# Altium schematic sheet Oximeter.SchDoc: Oximeter
size A3; SheetNumber: -; SheetTotal: -; RDL_Ersteller: Heig; RDL_FreigabeDatum: -; RDL_ErstellDatum: 09.12.2018; RDL_Freigegeben: -; RDL_Geaendert: -; RDL_GeaendertDatum: -; RDL_OrgEinheit: -; PageSetup: Record=PageOptions|CenterHorizontal=True|CenterVertical=True|PrintScale=1.00|XCorrection=1.00|YCorrection=1.00|PrintKind=0|BorderSize=5000000|LeftOffset=0|BottomOffset=0|Orientation=2|PaperLength=1000|PaperWidth=1000|Scale=100|PaperSource=7|PrintQuality=-3|MediaType=1|DitherType=10|PrintScaleMode=1|PaperKind=A4|PaperIndex=9; ProjectName: Oximeter
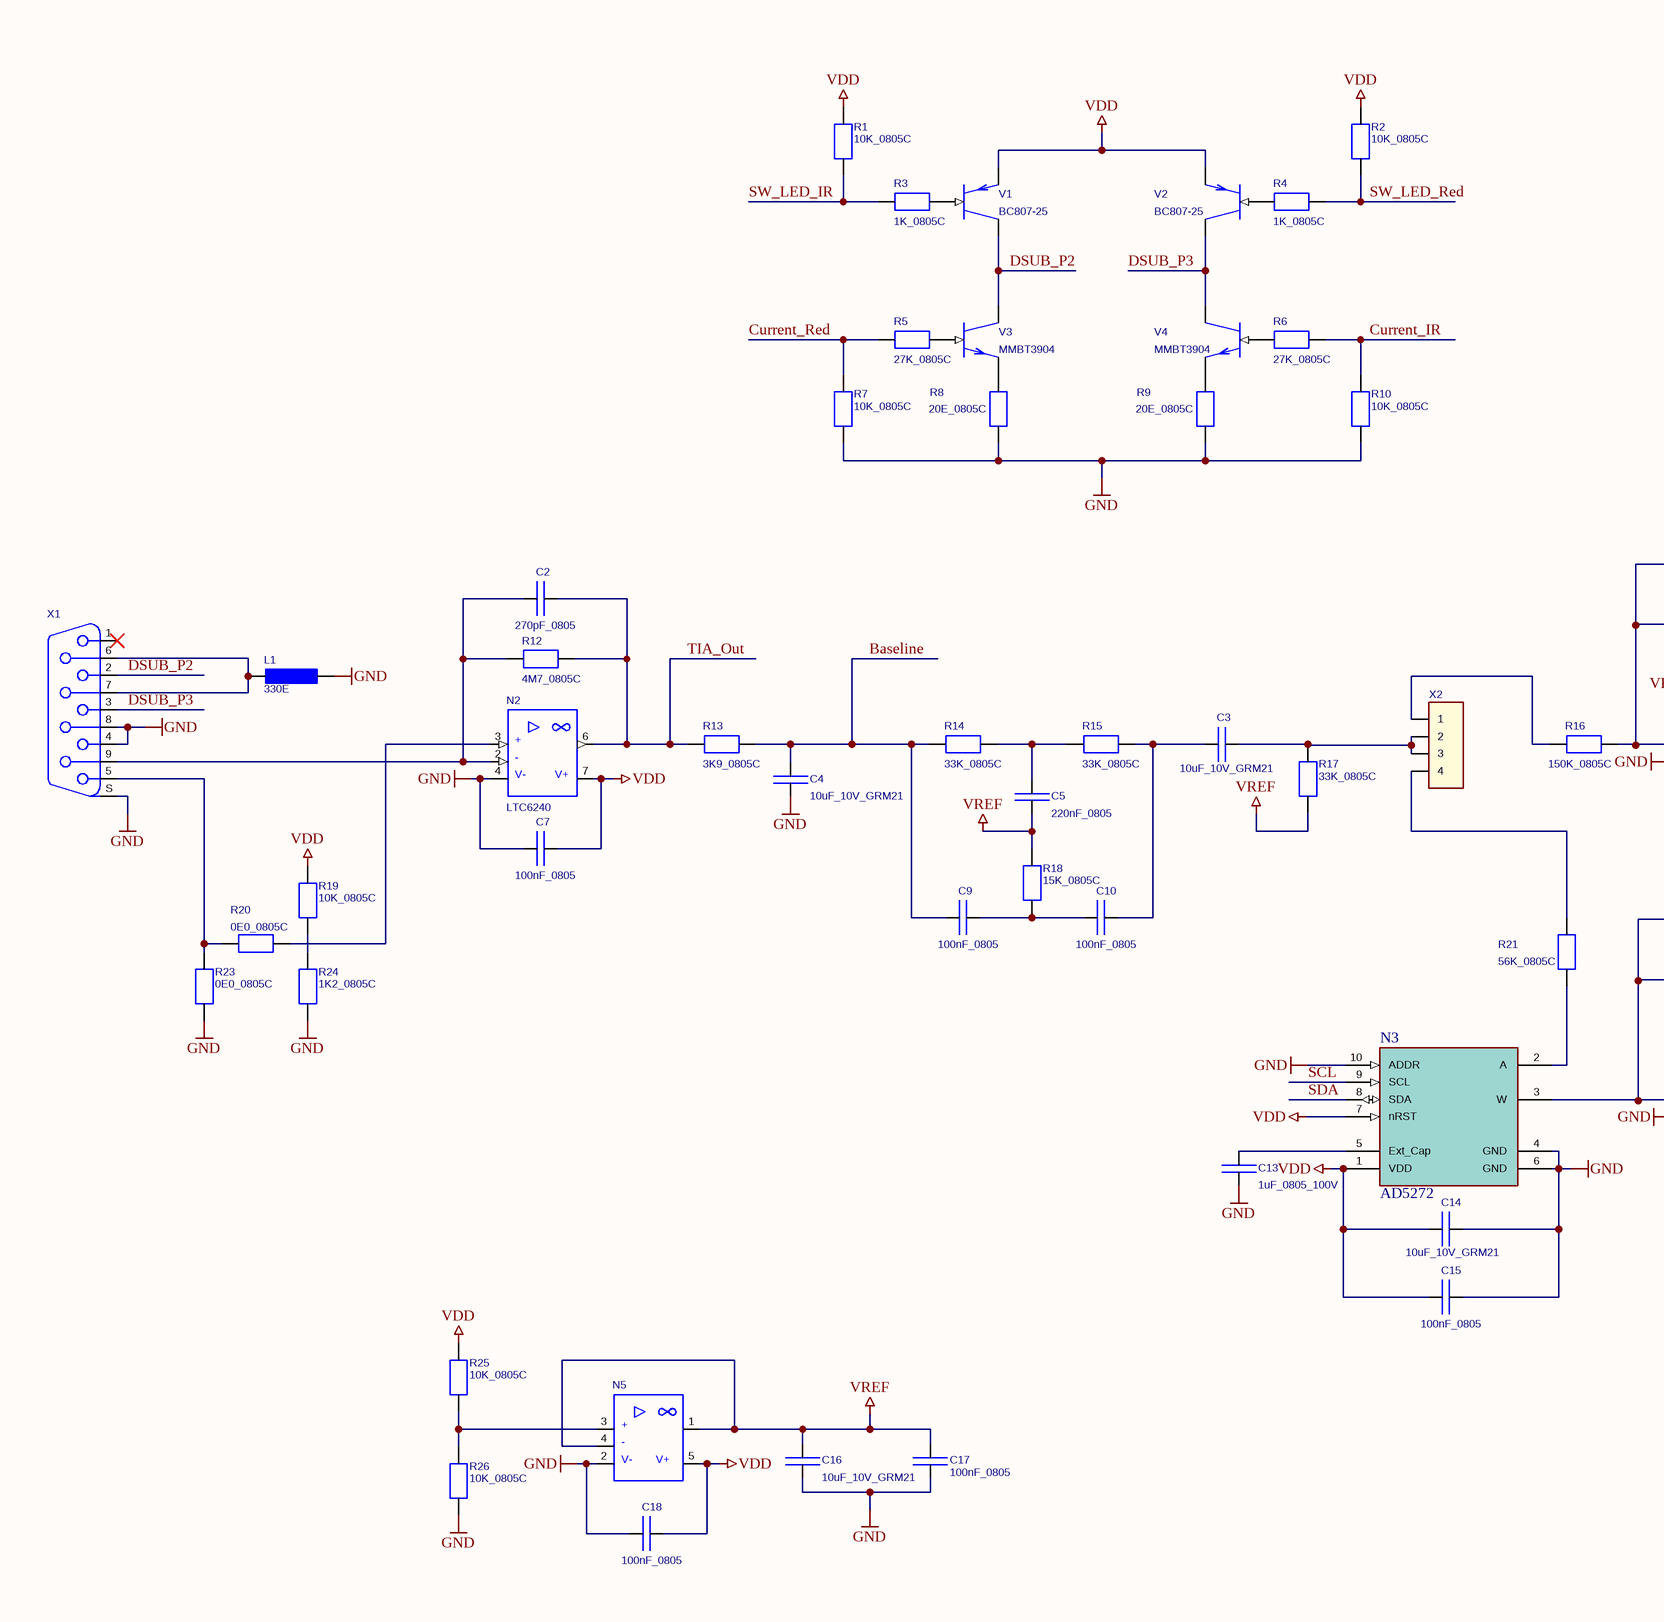
[diagram p0: Oximeter.SchDoc, left]
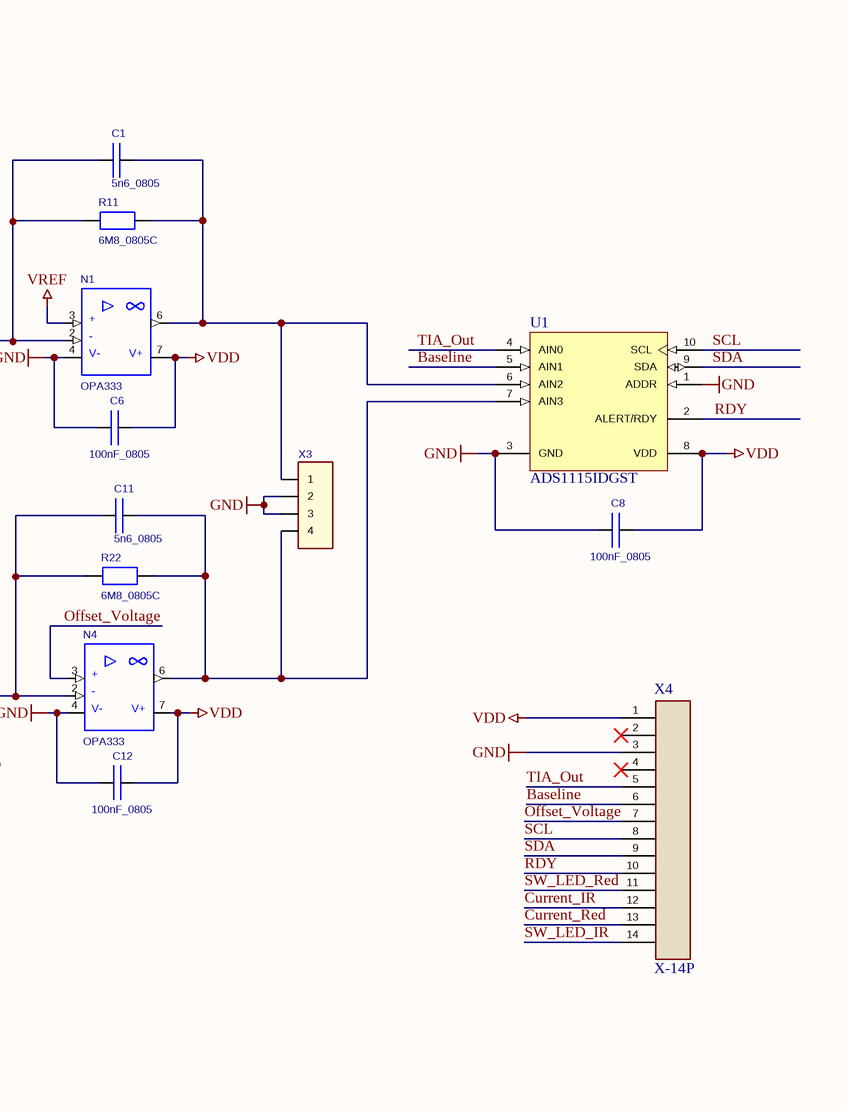
[diagram p1: Oximeter.SchDoc, right]

## Parts
C1  5n6_0805  [0805MIL]
C2  270pF_0805  [0805MIL]
C3  10uF_10V_GRM21  [0805MIL]
C4  10uF_10V_GRM21  [0805MIL]
C5  220nF_0805  [0805MIL]
C6  100nF_0805  [0805MIL]
C7  100nF_0805  [0805MIL]
C8  100nF_0805  [0805MIL]
C9  100nF_0805  [0805MIL]
C10  100nF_0805  [0805MIL]
C11  5n6_0805  [0805MIL]
C12  100nF_0805  [0805MIL]
C13  1uF_0805_100V  [0805MIL]
C14  10uF_10V_GRM21  [0805MIL]
C15  100nF_0805  [0805MIL]
C16  10uF_10V_GRM21  [0805MIL]
C17  100nF_0805  [0805MIL]
C18  100nF_0805  [0805MIL]
L1  330E  [0805MIL]
N1  OPA333  [SOP8_150_65]
N2  LTC6240  [SOP8_150_65]
N3  AD5272  [MSOP10]
N4  OPA333  [SOP8_150_65]
N5  TLV2371IDBVR  [SOT23-5]  (value not drawn)
R1  10K_0805C  [0805MIL]
R2  10K_0805C  [0805MIL]
R3  1K_0805C  [0805MIL]
R4  1K_0805C  [0805MIL]
R5  27K_0805C  [0805MIL]
R6  27K_0805C  [0805MIL]
R7  10K_0805C  [0805MIL]
R8  20E_0805C  [0805MIL]
R9  20E_0805C  [0805MIL]
R10  10K_0805C  [0805MIL]
R11  6M8_0805C  [0805MIL]
R12  4M7_0805C  [0805MIL]
R13  3K9_0805C  [0805MIL]
R14  33K_0805C  [0805MIL]
R15  33K_0805C  [0805MIL]
R16  150K_0805C  [0805MIL]
R17  33K_0805C  [0805MIL]
R18  15K_0805C  [0805MIL]
R19  10K_0805C  [0805MIL]
R20  0E0_0805C  [0805MIL]
R21  56K_0805C  [0805MIL]
R22  6M8_0805C  [0805MIL]
R23  0E0_0805C  [0805MIL]
R24  1K2_0805C  [0805MIL]
R25  10K_0805C  [0805MIL]
R26  10K_0805C  [0805MIL]
U1  ADS1115IDGST  [TI-DGS10_N]
V1  BC807-25  [SOT23]
V2  BC807-25  [SOT23]
V3  MMBT3904  [SOT23]
V4  MMBT3904  [SOT23]
X1  D-SUB9_S_ABG  [DSUB_9_F_ABG]  (value not drawn)
X2  SL1-053-04G  [SL105304]  (value not drawn)
X3  SL1-053-04G  [SL105304]  (value not drawn)
X4  X-14P  [SIP14]

## Nets
GND: C4.2 C6.1 C7.1 C8.1 C12.1 C13.2 C14.2 C15.2 C16.2 C17.1 C18.1 L1.2 N1.4(V-) N2.4(V-) N3.4(GND) N3.6(GND) N3.10(ADDR) N4.4(V-) N5.2(GND) R7.2 R8.2 R9.2 R10.2 R23.2 R24.2 R26.2 U1.1(ADDR) U1.3(GND) X1.4 X1.8 X1.S X3.2 X3.3 X4.3
VDD: C6.2 C7.2 C8.2 C12.2 C14.1 C15.1 C18.2 N1.7(V+) N2.7(V+) N3.1(VDD) N3.7(nRST) N4.7(V+) N5.5(VDD) R1.1 R2.1 R19.1 R25.1 U1.8(VDD) V1.2 V2.2 X4.1
VREF: C5.2 C16.1 C17.2 N1.3(IN1+) N5.1(OUTPUT) N5.4(MINUS_INPUT) R17.2 R18.1
Baseline: C4.1 C9.1 R13.1 R14.2 U1.5(AIN1) X4.6
Current_IR: R6.1 R10.1 X4.12
Current_Red: R5.2 R7.1 X4.13
DSUB_P2: V1.3 V3.3(C) X1.2
DSUB_P3: V2.3 V4.3(C) X1.3
Offset_Voltage: N4.3(IN1+) X4.7
RDY: U1.2(ALERT/RDY) X4.10
SCL: N3.9(SCL) U1.10(SCL) X4.8
SDA: N3.8(SDA) U1.9(SDA) X4.9
SW_LED_IR: R1.2 R3.2 X4.14
SW_LED_Red: R2.2 R4.1 X4.11
TIA_Out: C2.2 N2.6(Out1) R12.1 R13.2 U1.4(AIN0) X4.5
NetC1_1: C1.1 N1.2(IN1-) R11.2 R16.1
NetC1_2: C1.2 N1.6(Out1) R11.1 U1.6(AIN2) X3.1
NetC2_1: C2.1 N2.2(IN1-) R12.2 X1.9
NetC3_1: C3.1 C10.2 R15.1
NetC3_2: C3.2 R17.1 X2.2 X2.3
NetC5_1: C5.1 R14.1 R15.2
NetC9_2: C9.2 C10.1 R18.2
NetC11_1: C11.1 N3.3(W) N4.2(IN1-) R22.2
NetC11_2: C11.2 N4.6(Out1) R22.1 U1.7(AIN3) X3.4
NetC13_1: C13.1 N3.5(Ext_Cap)
NetL1_1: L1.1 X1.6 X1.7
NetN2_3: N2.3(IN1+) R20.1
NetN3_2: N3.2(A) R21.2
NetN5_3: N5.3(PLUS_INPUT) R25.2 R26.1
NetR3_1: R3.1 V1.1
NetR4_2: R4.2 V2.1
NetR5_1: R5.1 V3.1(B)
NetR6_2: R6.2 V4.1(B)
NetR8_1: R8.1 V3.2(E)
NetR9_1: R9.1 V4.2(E)
NetR16_2: R16.2 X2.1
NetR19_2: R19.2 R24.1
NetR20_2: R20.2 R23.1 X1.5
NetR21_1: R21.1 X2.4

Not connected (* = marked no-connect by the designer): X1 1*; X4 2* 4*

## Notes on the sheet
- Format:
- Anlage:
- Ort:
- A3
- Labor/Büro:
- von:
- Blatt:
- Alle Rechte für den Fall der Patent-, Gebrauchsmuster- oder Geschmacksmustereintragung vorbehalten.
- verboten, soweit nicht ausdrücklich gestattet. Zuwiderhandlungen verpflichten zu Schadenersatz.
- Weitergabe sowie Vervielfältigung dieses Dokuments, Verwendung und Mitteilung seines Inhalts sind
- CAGE Code:
- S7478
- Anwendung:
- Altium
- erstellt:
- freigegeben:
- geändert:
- Dok.-Art
- Dokument-Nr.
- Teil-Dok.
- DE0
- Version
- Revision
- (in symbol 2564.2212) +; -
- (in symbol 8015.8017) +; -; V-; V+

## Library data of the parts
C1 C11 = 2506.1521: Kond.Keramik SMD Typ X7R 2,2nF B37941-K5222-K60 0805; Part Grp: VIII; Manufacturer: Epcos; IEC: CKE; Voltage: 50V; Tolerance: 10%; Part Number: 2506.1521; Part Type: Keramik\SMD; SMD: Ja; Supplier 1: Distrelec; Supplier Part Number 1: 83 06 56; ROHS: Nein; #Footprint Old#: 0805MIL; ComponentLink1Description: Datasheet; ComponentLink1URL: P:\Datasheets\Kondensatoren\B37xxkeramik.pdf
C2 = 2506.1509: Kond.Keramik Siemens Typ COG SMD 0805; Part Grp: VIII; IEC: CKE; Part Number: 2506.1509; Part Type: Keramik\SMD; SMD: Ja; Manufacturer: Siemens; ROHS: Nein; #Footprint Old#: 0805MIL; ComponentLink1Description: Datasheet; ComponentLink1URL: P:\Datasheets\Kondensatoren\KERKOND.pdf
C3 C4 C14 C16 = 2541.8615: Monolithic Ceramic Capacitor 10uF/10V GRM21BR61A106KE19L; Part Grp: VIII; Manufacturer: MyRata; IEC: CKE; Voltage: 10V; Tolerance: 10%; Part Number: 2541.8615; Part Type: Keramik\SMD; SMD: Ja; Manufacturer Part Nr: GRM21BR61A106KE19L; Supplier 1: Distrelec; Supplier Part Number 1: 82 35 11; ROHS: Nein; #Footprint Old#: 0805MIL; ComponentLink1Description: Datasheet; ComponentLink1URL: P:\Datasheets\Kondensatoren\GRM319.pdf
C5 = 2506.1529: Kond.Keramik Siemens Typ X7R SMD 0805; Part Grp: VIII; IEC: CKE; Part Number: 2506.1529; Part Type: Keramik\SMD; SMD: Ja; Manufacturer: Siemens; Supplier 1: Distrelec; Supplier Part Number 1: 83 14 67; ROHS: Nein; #Footprint Old#: 0805MIL; ComponentLink1Description: Datasheet; ComponentLink1URL: P:\Datasheets\Kondensatoren\KERKOND.pdf
C6-C10 C12 C15 C17 C18 = 2504.0981: Kond.Keramik Typ X7R SMD 0805 100nF; Part Grp: VIII; Manufacturer: Kemet; IEC: CKE; Voltage: 50V; Tolerance: 10%; Part Number: 2504.0981; Part Type: Keramik\SMD; SMD: Ja; Supplier 1: Distrelec; Supplier Part Number 1: 83 14 69; ROHS: Nein; #Footprint Old#: 0805MIL; ComponentLink1Description: Datasheet; ComponentLink1URL: P:\Datasheets\Kondensatoren\Kemet-keramik.pdf
C13 = 2567.7027: Kond.Keramik TDK Typ X7S SMD 0805 1uF/100V; Manufacturer Part Nr: C2012X7S2A105K125AB; IEC: CKE; Part Number: 2567.7027; Part Type: Keramik; SMD: Ja; Manufacturer: TDK; Supplier 1: Farnell; Supplier Part Number 1: 211-2709; Max Operating Temp: 125; Min Operating Temp: -55; ROHS: Ja; ComponentLink1Description: Datasheet; ComponentLink1URL: P:\Datasheets\Kondensatoren\TDK_CHIP.pdf
L1 = 2571.6206: SMD Ferrit MPZ2012S331A 330Ohm; Part Grp: V; Manufacturer: TDK; IEC: LFE; Part Number: 2571.6206; Part Type: Ferrit; SMD: Ja; Manufacturer Part Nr: MPZ2012S331A; Supplier 1: Mouser; Supplier Part Number 1: 810-MPZ2012S331AT000; Max Operating Temp: 125; Min Operating Temp: -55; ROHS: Ja; ComponentLink1Description: Datasheet; ComponentLink1URL: P:\Datasheets\Ferrite\TDK_MPZ Serie.pdf
N1 N2 N4 = 2564.2212: SMD Low Power Precision Op.Amp. OPA211AIDR SOIC8; Part Grp: I; Manufacturer: Texas Instruments; NC: 1,5,8; IEC: NOP; #Footprint Old#: SOIC_8; Part Number: 2564.2212; Part Type: Signalverarbeitung\Operationsverstaerker; SMD: Ja; Manufacturer Part Nr: OPA211AIDR; Supplier 1: Digikey; Supplier Part Number 1: OPA211AIDR; Max Operating Temp: 150; Min Operating Temp: -55; ROHS: Ja; ComponentLink1Description: Datasheet; ComponentLink1URL: P:\Datasheets\Analoge_Schaltungen\OPA211.pdf
N3 = N-AD5272: Digitalpotentiometer 1024tap 100k; Text Field1: Op.Amp. / Offset corr.n / Freqency comp.
N5 = 8015.8017: 3MHz Rail-to-Rail OpAmp TLV2371IDBVR SOT23-5; Part Grp: I; Manufacturer: Texas Instruments; IEC: NOP; Part Number: 8015.8017; Part Type: Signalverarbeitung\Operationsverstaerker; SMD: Ja; Manufacturer Part Nr: TLV2371IDBVR; Supplier 1: Mouser; Supplier Part Number 1: 595-TLV2371IDBVR; ROHS: Ja; ComponentLink1Description: Datasheet; ComponentLink1URL: P:\Datasheets\Analoge_Schaltungen\TLV2371.pdf
R1 R2 R7 R10 R19 R25 R26 = 2522.1838: Widerst.Chip SMD 1% 0.1W 0805 Serie HMWA 10 kOhm; Part Grp: XII; Manufacturer: Royal Ohm; IEC: RSH; Part Number: 2522.1838; Part Type: Schichtwiderstand\SMD; SMD: Ja; Supplier 1: Farnell; Supplier Part Number 1: 911-975; ROHS: Nein; #Footprint Old#: 0805MIL; ComponentLink1Description: Datasheet; ComponentLink1URL: P:\Datasheets\Widerstaende\Chip_0805.pdf
R3 R4 = 2522.1806: Widerst.Chip SMD 1% 0.1W 0805 Serie HMWA 1 kOhm; Part Grp: XII; Manufacturer: Royal Ohm; IEC: RSH; Part Number: 2522.1806; Part Type: Schichtwiderstand\SMD; SMD: Ja; Supplier 1: Farnell; Supplier Part Number 1: 911-859; ROHS: Nein; #Footprint Old#: 0805MIL; ComponentLink1Description: Datasheet; ComponentLink1URL: P:\Datasheets\Widerstaende\Chip_0805.pdf
R5 R6 = 2522.1849: Widerst.Chip SMD 1% 0.1W 0805 Serie HMWA 27 kOhm; Part Grp: XII; Manufacturer: Royal Ohm; IEC: RSH; Part Number: 2522.1849; Part Type: Schichtwiderstand\SMD; SMD: Ja; Supplier 1: Farnell; Supplier Part Number 1: 912-025; ROHS: Nein; #Footprint Old#: 0805MIL; ComponentLink1Description: Datasheet; ComponentLink1URL: P:\Datasheets\Widerstaende\Chip_0805.pdf
R8 R9 = 2544.3651: Widerst.Chip SMD 0.1% 0.1W 0805 Serie RN73 20 Ohm; Part Grp: XII; Manufacturer: TYCO/Holsworthy; IEC: RSH; Part Number: 2544.3651; Part Type: Schichtwiderstand\SMD; SMD: Ja; Supplier 1: Farnell; Supplier Part Number 1: 114-0651; ROHS: Nein; #Footprint Old#: 0805MIL; ComponentLink1Description: Datasheet; ComponentLink1URL: P:\Datasheets\Widerstaende\Chip_0805_RN73.pdf
R11 R12 R22 = 2522.1895: Widerst.Chip SMD 1% 0.1W 0805 Serie HMWA 1 MOhm; Part Grp: XII; Manufacturer: Royal Ohm; IEC: RSH; Part Number: 2522.1895; Part Type: Schichtwiderstand\SMD; SMD: Ja; Supplier 1: Farnell; Supplier Part Number 1: 912-219; ROHS: Nein; #Footprint Old#: 0805MIL; ComponentLink1Description: Datasheet; ComponentLink1URL: P:\Datasheets\Widerstaende\Chip_0805.pdf
R13 = 2522.1824: Widerst.Chip SMD 1% 0.1W 0805 Serie HMWA 3,9 kOhm; Part Grp: XII; Manufacturer: Royal Ohm; IEC: RSH; Part Number: 2522.1824; Part Type: Schichtwiderstand\SMD; SMD: Ja; Supplier 1: Farnell; Supplier Part Number 1: 911-926; ROHS: Nein; #Footprint Old#: 0805MIL; ComponentLink1Description: Datasheet; ComponentLink1URL: P:\Datasheets\Widerstaende\Chip_0805.pdf
R14 R15 R17 = 2522.1851: Widerst.Chip SMD 1% 0.1W 0805 Serie HMWA 33 kOhm; Part Grp: XII; Manufacturer: Royal Ohm; IEC: RSH; Part Number: 2522.1851; Part Type: Schichtwiderstand\SMD; SMD: Ja; Supplier 1: Farnell; Supplier Part Number 1: 912-037; ROHS: Nein; #Footprint Old#: 0805MIL; ComponentLink1Description: Datasheet; ComponentLink1URL: P:\Datasheets\Widerstaende\Chip_0805.pdf
R16 = 2522.1871: Widerst.Chip SMD 1% 0.1W 0805 Serie HMWA 150 kOhm; Part Grp: XII; Manufacturer: Royal Ohm; IEC: RSH; Part Number: 2522.1871; Part Type: Schichtwiderstand\SMD; SMD: Ja; Supplier 1: Farnell; Supplier Part Number 1: 912-166; ROHS: Nein; #Footprint Old#: 0805MIL; ComponentLink1Description: Datasheet; ComponentLink1URL: P:\Datasheets\Widerstaende\Chip_0805.pdf
R18 = 2522.1843: Widerst.Chip SMD 1% 0.1W 0805 Serie HMWA 15 kOhm; Part Grp: XII; Manufacturer: Royal Ohm; IEC: RSH; Part Number: 2522.1843; Part Type: Schichtwiderstand\SMD; SMD: Ja; Supplier 1: Farnell; Supplier Part Number 1: 911-999; ROHS: Nein; #Footprint Old#: 0805MIL; ComponentLink1Description: Datasheet; ComponentLink1URL: P:\Datasheets\Widerstaende\Chip_0805.pdf
R20 R23 = 2524.7986: Widerst.Chip SMD 1% 0.1W 0805 Serie HMWA 0Ohm; Part Grp: XII; Manufacturer: Royal Ohm; IEC: RSH; Part Number: 2524.7986; Part Type: Schichtwiderstand\SMD; SMD: Ja; Supplier 1: Farnell; Supplier Part Number 1: 772-239; ROHS: Nein; #Footprint Old#: 0805MIL; ComponentLink1Description: Datasheet; ComponentLink1URL: P:\Datasheets\Widerstaende\Chip_0805.pdf
R21 = 2522.1858: Widerst.Chip SMD 1% 0.1W 0805 Serie HMWA 56 kOhm; Part Grp: XII; Manufacturer: Royal Ohm; IEC: RSH; Part Number: 2522.1858; Part Type: Schichtwiderstand\SMD; SMD: Ja; Supplier 1: Farnell; Supplier Part Number 1: 912-062; ROHS: Nein; #Footprint Old#: 0805MIL; ComponentLink1Description: Datasheet; ComponentLink1URL: P:\Datasheets\Widerstaende\Chip_0805.pdf
R24 = 2522.1809: Widerst.Chip SMD 1% 0.1W 0805 Serie HMWA 1,2 kOhm; Part Grp: XII; Manufacturer: Royal Ohm; IEC: RSH; Part Number: 2522.1809; Part Type: Schichtwiderstand\SMD; SMD: Ja; Supplier 1: Farnell; Supplier Part Number 1: 911-860; ROHS: Nein; #Footprint Old#: 0805MIL; ComponentLink1Description: Datasheet; ComponentLink1URL: P:\Datasheets\Widerstaende\Chip_0805.pdf
U1 = ADS1115IDGST: 16-Bit ADC with Integrated Multiplexer, PGA, Comparator, Oscillator, and Reference, -40 to 125 degC, 10-pin SOP (DGS10), Green (RoHS & no Sb/Br); Manufacturer: Texas Instruments; # Input Channels: 4; Analog Voltage AV/DD(Max)(V): 5.5; Analog Voltage AV/DD(Min)(V): 2; Architecture: Delta-Sigma; INL(Max)(+/-LSB): 1; Interface: Serial I2C; Resolution(Bits): 16; Sample Rate (max)(SPS): 860; SubFamily: Precision ADC (<=10MSPS); DatasheetVersion: SBAS444B; PackageVersion: 4073272/C, 02/2004; PackageReference: DGS10; PackageDescription: 10-Pin Plastic Small Outline, Body 3 x 3 mm, Pitch 0.5 mm; Supplier 1: Digi-Key; Supplier Part Number 1: ADS1253E/2K5G4-ND; Supplier 2: Mouser; Supplier Part Number 2: 595-ADS1253E/2K5G4; Digital Supply(Max)(V): 5.5; Digital Supply(Min)(V): 2; Eco-Plan: Green (RoHS & no Sb/Br); Mounting Technology: Surface Mount; Code_JEDEC: MO-153; PartNumber: ADS1115IDGST; ComponentLink1Description: Manufacturer URL; ComponentLink1URL: http://www.ti.com/; ComponentLink2Description: Datasheet; ComponentLink2URL: http://www.ti.com/general/docs/lit/getliterature.tsp?genericPartNumber=ADS1115&fileType=pdf; ComponentLink3Description: Package Specification; ComponentLink3URL: http://www.ti.com/lit/ml/mpds035b/mpds035b.pdf
V1 V2 = 2110.8189: PNP-Transistor SMD BC807-25 SOT-23; Part Grp: III; Manufacturer: NXP; IEC: VPN; Part Number: 2110.8189; Part Type: Transistoren\PNP; SMD: Ja; Manufacturer Part Nr: BC807-25; Supplier 1: Farnell; Supplier Part Number 1: 108-1221; ROHS: Ja; #Footprint Old#: SOT23; ComponentLink1Description: Datasheet; ComponentLink1URL: P:\Datasheets\Diskrete_Halbleiter\BC807.pdf
V3 V4 = 2544.3690: Transistor NPN MMBT3904 SOT-23; Part Grp: III; Manufacturer: Fairchild; IEC: VNP; Name: rlegm; Part Number: 2544.3690; Part Type: Transistoren\NPN; SMD: Ja; Supplier 1: Farnell; Supplier Part Number 1: 984-6727; ROHS: Nein; #Footprint Old#: SOT23; ComponentLink1Description: Datasheet; ComponentLink1URL: P:\Datasheets\Diskrete_Halbleiter\MMBT3904.pdf; Date: 07.09.2015
X1 = 2570.6888: D-SUB 9 Sok 90° mit Winkel und Abstandsbolzen DT09SYC1M63UNB6; Part Grp: IV; Manufacturer: Deltron; IEC: XDS; Part Number: 2570.6888; Part Type: Steckerverbinder\D-SUB; SMD: Nein; Manufacturer Part Nr: DT09SYC1M63UNB6; Supplier 1: Deltron; Supplier Part Number 1: DT09SYC1M63UNB6; ROHS: Ja; ComponentLink1Description: Datasheet; ComponentLink1URL: P:\Datasheets\Elektromechanik\Deltron_DSUB_ABG.pdf
X2 X3 = 2552.7782: 2.54mm Stiftleiste 1reihig 4pol gerade SL1 053 04G; Part Grp: IV; Manufacturer: Fischer; IEC: XDI; #Footprint Old#: SL4X1_254; Part Number: 2552.7782; Part Type: Steckerverbinder; SMD: Nein; Manufacturer Part Nr: SL1-053-04G; Supplier 1: Astrel; Supplier Part Number 1: SL1 053 04G; Max Operating Temp: 105; Min Operating Temp: -40; ROHS: Ja; ComponentLink1Description: Datasheet; ComponentLink1URL: P:\Datasheets\Elektromechanik\SL1_053.pdf
X4 = X-14P: Stiftenleiste 14 pin